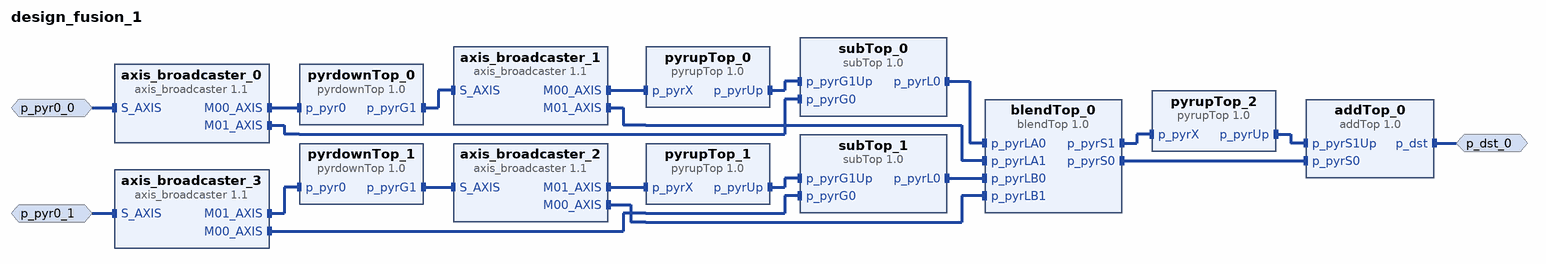
[diagram p0: block diagram of the top level]
# Vivado block design design_fusion_1, xc7z020clg484-1, Vivado 2019.1
create_bd_design design_fusion_1

create_bd_intf_port -mode Slave -vlnv xilinx.com:interface:axis_rtl:1.0 p_pyr0_0
set_property -dict [list \
  CONFIG.HAS_TKEEP 1 \
  CONFIG.HAS_TLAST 1 \
  CONFIG.HAS_TREADY 1 \
  CONFIG.HAS_TSTRB 1 \
  CONFIG.LAYERED_METADATA undef \
  CONFIG.TDATA_NUM_BYTES 1 \
  CONFIG.TDEST_WIDTH 1 \
  CONFIG.TID_WIDTH 1 \
  CONFIG.TUSER_WIDTH 1 \
] [get_bd_intf_ports p_pyr0_0]
create_bd_intf_port -mode Slave -vlnv xilinx.com:interface:axis_rtl:1.0 p_pyr0_1
set_property -dict [list \
  CONFIG.HAS_TKEEP 1 \
  CONFIG.HAS_TLAST 1 \
  CONFIG.HAS_TREADY 1 \
  CONFIG.HAS_TSTRB 1 \
  CONFIG.LAYERED_METADATA undef \
  CONFIG.TDATA_NUM_BYTES 1 \
  CONFIG.TDEST_WIDTH 1 \
  CONFIG.TID_WIDTH 1 \
  CONFIG.TUSER_WIDTH 1 \
] [get_bd_intf_ports p_pyr0_1]
create_bd_intf_port -mode Master -vlnv xilinx.com:interface:axis_rtl:1.0 p_dst_0

create_bd_cell -type ip -vlnv xilinx.com:ip:axis_broadcaster:1.1 axis_broadcaster_0
create_bd_cell -type ip -vlnv xilinx.com:ip:axis_broadcaster:1.1 axis_broadcaster_1
create_bd_cell -type ip -vlnv xilinx.com:ip:axis_broadcaster:1.1 axis_broadcaster_2
create_bd_cell -type ip -vlnv xilinx.com:ip:axis_broadcaster:1.1 axis_broadcaster_3
create_bd_cell -type ip -vlnv xilinx.com:hls:pyrdownTop:1.0 pyrdownTop_0
create_bd_cell -type ip -vlnv xilinx.com:hls:pyrdownTop:1.0 pyrdownTop_1
create_bd_cell -type ip -vlnv xilinx.com:hls:addTop:1.0 addTop_0
create_bd_cell -type ip -vlnv xilinx.com:hls:blendTop:1.0 blendTop_0
create_bd_cell -type ip -vlnv xilinx.com:hls:pyrupTop:1.0 pyrupTop_0
create_bd_cell -type ip -vlnv xilinx.com:hls:pyrupTop:1.0 pyrupTop_1
create_bd_cell -type ip -vlnv xilinx.com:hls:pyrupTop:1.0 pyrupTop_2
create_bd_cell -type ip -vlnv xilinx.com:hls:subTop:1.0 subTop_0
create_bd_cell -type ip -vlnv xilinx.com:hls:subTop:1.0 subTop_1

# ---- connections ----

connect_bd_intf_net [get_bd_intf_pins subTop_1/p_pyrL0] [get_bd_intf_pins blendTop_0/p_pyrLB0]
connect_bd_intf_net [get_bd_intf_pins pyrupTop_1/p_pyrUp] [get_bd_intf_pins subTop_1/p_pyrG1Up]
connect_bd_intf_net [get_bd_intf_pins subTop_0/p_pyrL0] [get_bd_intf_pins blendTop_0/p_pyrLA0]
connect_bd_intf_net [get_bd_intf_pins pyrdownTop_1/p_pyrG1] [get_bd_intf_pins axis_broadcaster_2/S_AXIS]
connect_bd_intf_net [get_bd_intf_pins axis_broadcaster_0/M01_AXIS] [get_bd_intf_pins subTop_0/p_pyrG0]
connect_bd_intf_net [get_bd_intf_pins pyrupTop_2/p_pyrUp] [get_bd_intf_pins addTop_0/p_pyrS1Up]
connect_bd_intf_net [get_bd_intf_pins axis_broadcaster_0/M00_AXIS] [get_bd_intf_pins pyrdownTop_0/p_pyr0]
connect_bd_intf_net [get_bd_intf_pins pyrupTop_0/p_pyrUp] [get_bd_intf_pins subTop_0/p_pyrG1Up]
connect_bd_intf_net -intf_net p_pyr0_0_1 [get_bd_intf_ports p_pyr0_0] [get_bd_intf_pins axis_broadcaster_0/S_AXIS]
connect_bd_intf_net [get_bd_intf_pins axis_broadcaster_2/M01_AXIS] [get_bd_intf_pins pyrupTop_1/p_pyrX]
connect_bd_intf_net [get_bd_intf_pins axis_broadcaster_1/M01_AXIS] [get_bd_intf_pins blendTop_0/p_pyrLA1]
connect_bd_intf_net [get_bd_intf_pins axis_broadcaster_1/M00_AXIS] [get_bd_intf_pins pyrupTop_0/p_pyrX]
connect_bd_intf_net [get_bd_intf_pins pyrdownTop_0/p_pyrG1] [get_bd_intf_pins axis_broadcaster_1/S_AXIS]
connect_bd_intf_net [get_bd_intf_pins axis_broadcaster_3/M00_AXIS] [get_bd_intf_pins subTop_1/p_pyrG0]
connect_bd_intf_net [get_bd_intf_pins blendTop_0/p_pyrS1] [get_bd_intf_pins pyrupTop_2/p_pyrX]
connect_bd_intf_net [get_bd_intf_pins axis_broadcaster_3/M01_AXIS] [get_bd_intf_pins pyrdownTop_1/p_pyr0]
connect_bd_intf_net -intf_net p_pyr0_1_1 [get_bd_intf_ports p_pyr0_1] [get_bd_intf_pins axis_broadcaster_3/S_AXIS]
connect_bd_intf_net [get_bd_intf_pins axis_broadcaster_2/M00_AXIS] [get_bd_intf_pins blendTop_0/p_pyrLB1]
connect_bd_intf_net [get_bd_intf_ports p_dst_0] [get_bd_intf_pins addTop_0/p_dst]
connect_bd_intf_net [get_bd_intf_pins blendTop_0/p_pyrS0] [get_bd_intf_pins addTop_0/p_pyrS0]

validate_bd_design
save_bd_design
